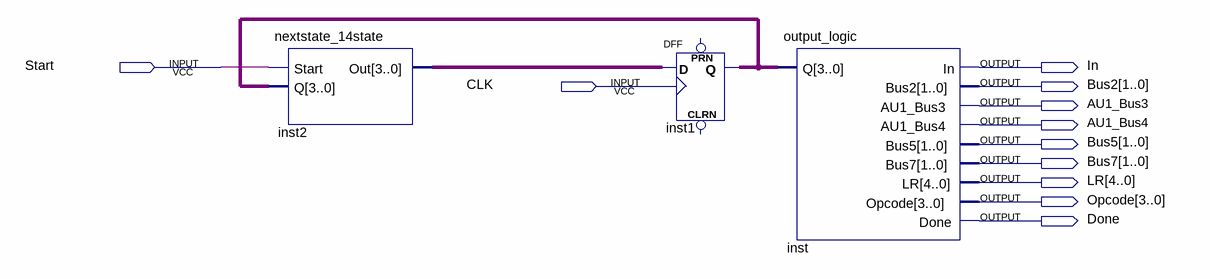
[diagram p0: schematic sheet]
// Quartus schematic Control_14.bdf as structural Verilog: 3 symbols, 11 pins
module Control_14 (
  input  Start,
  input  CLK,
  output In,
  output [1:0] Bus2,
  output AU1_Bus3,
  output AU1_Bus4,
  output [1:0] Bus5,
  output [1:0] Bus7,
  output [4:0] LR,
  output [3:0] Opcode,
  output Done
);

  wire [3:0] inst1_q, inst2_out;

  nextstate_14state inst2 (.Start(Start), .Q(inst1_q), .Out(inst2_out));
  DFF inst1[3:0] (.CLK(CLK), .D(inst2_out), .Q(inst1_q));  // open: CLRN, PRN
  output_logic inst (
    .Q(inst1_q), .In(In), .Bus2(Bus2), .AU1_Bus3(AU1_Bus3), .AU1_Bus4(AU1_Bus4), .Bus5(Bus5), .Bus7(Bus7),
    .LR(LR), .Opcode(Opcode), .Done(Done));
endmodule
